# Altium schematic sheet FrontPanel.SchDoc
size A3; SheetNumber: 1; SheetTotal: 1
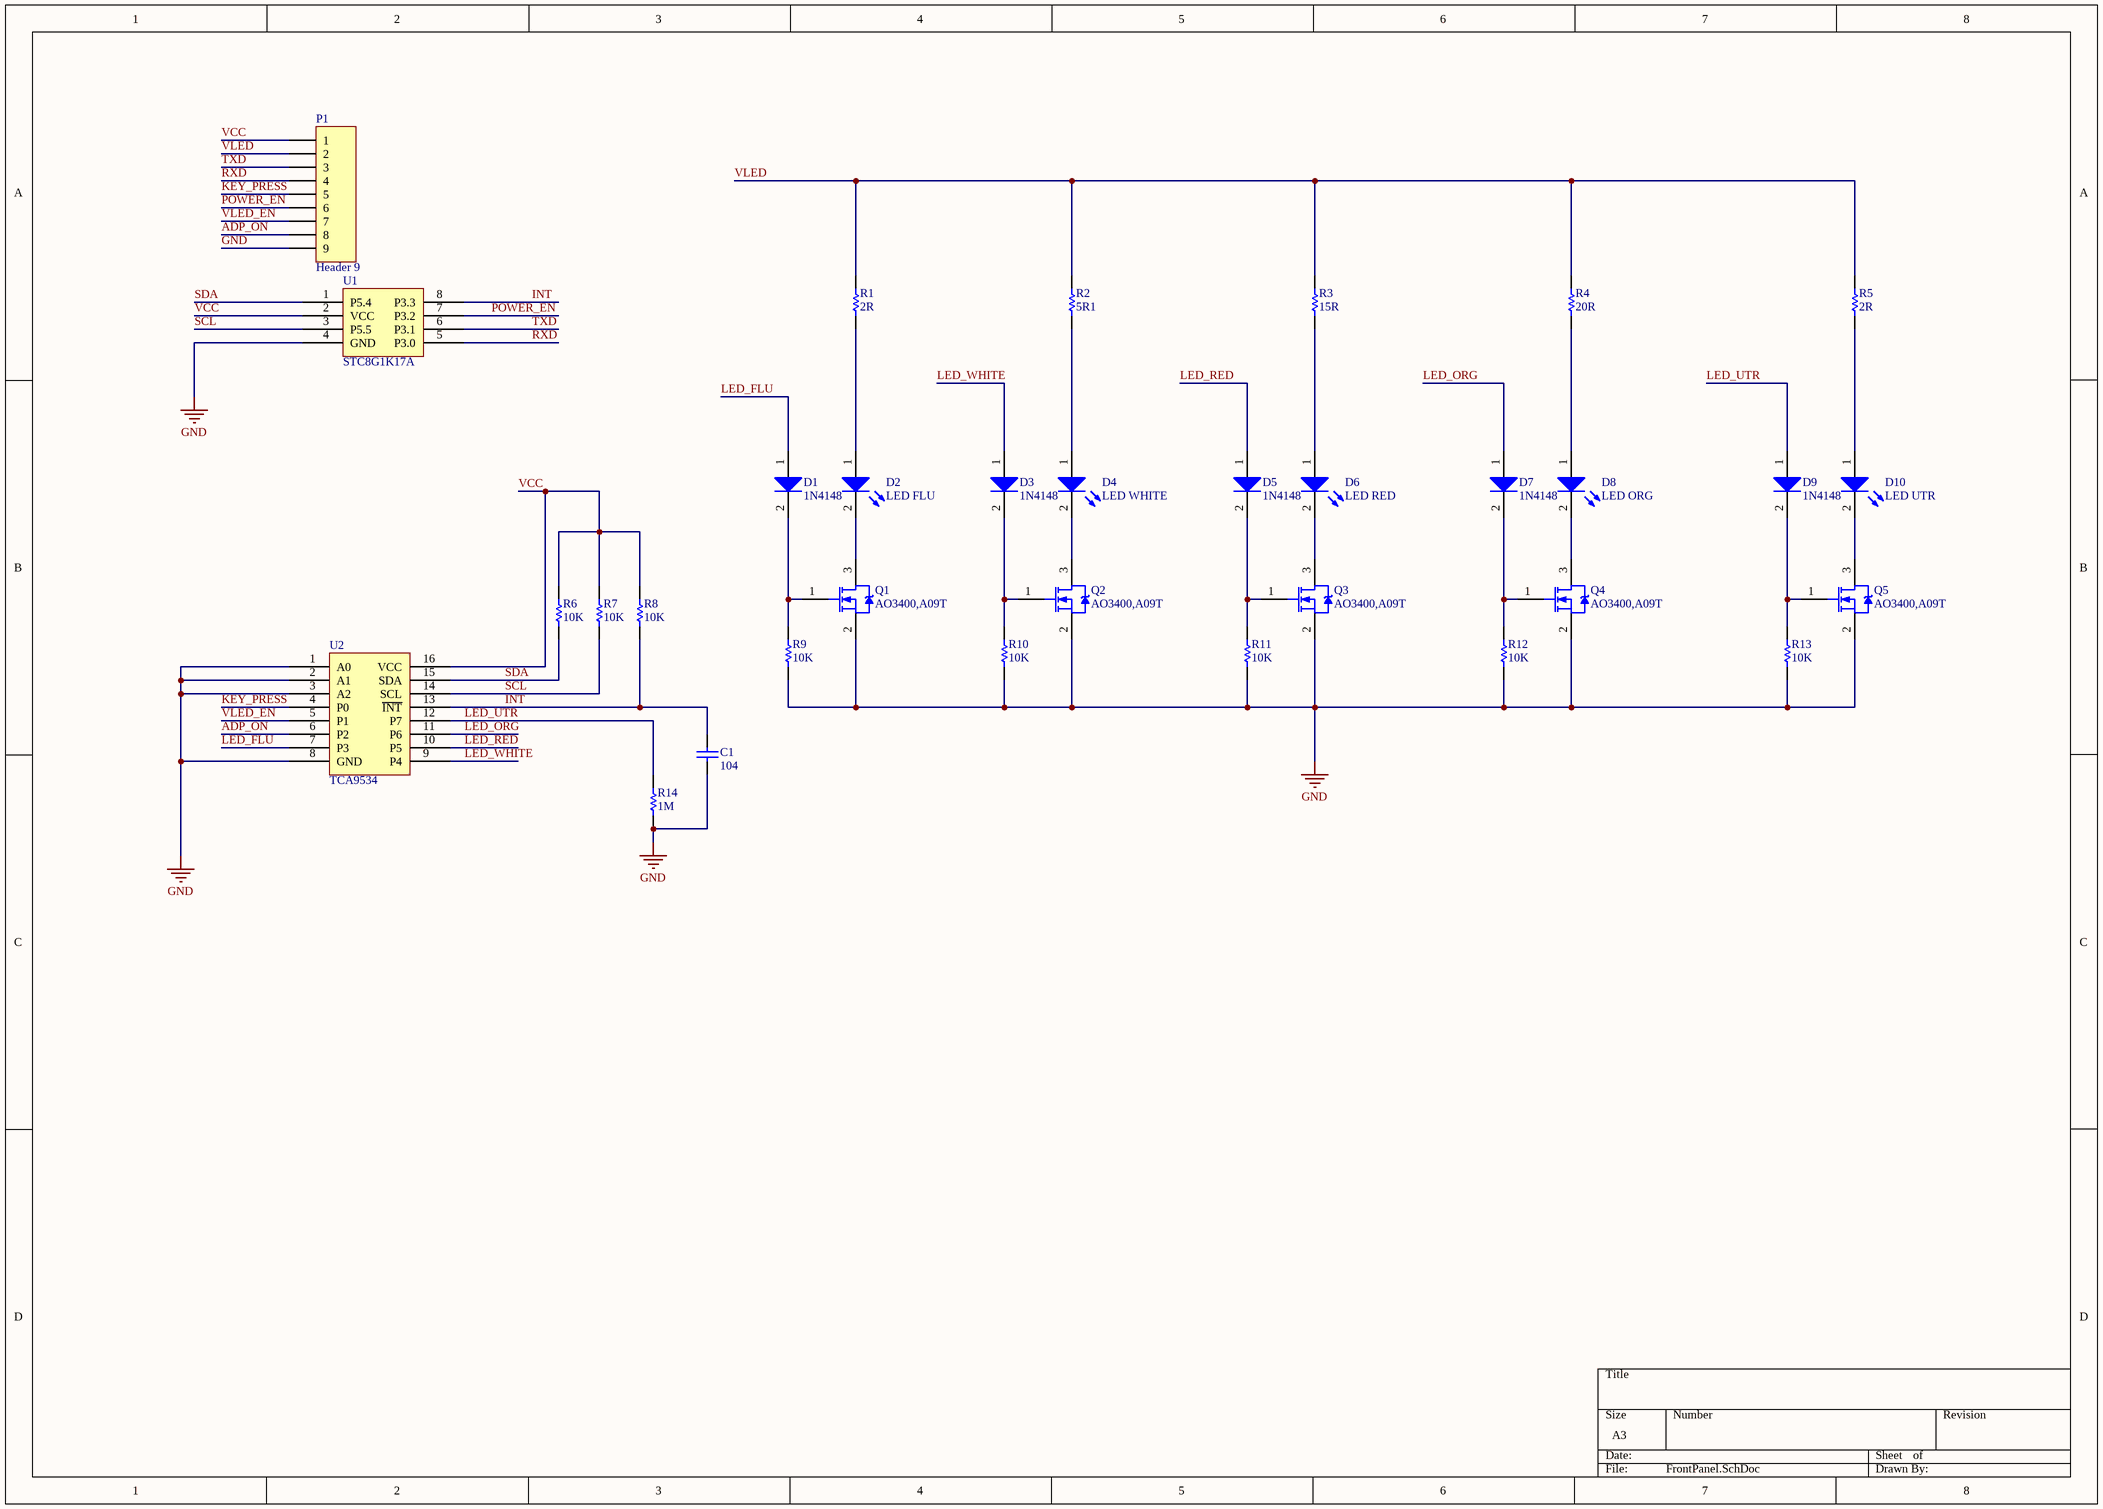
[diagram p0: FrontPanel.SchDoc]

## Parts
C1  value 104  [CAPC1608L]
D1  1N4148  [CD3216-1206]
D2  LED FLU  [LEDCHIP2835]
D3  1N4148  [CD3216-1206]
D4  LED WHITE  [LEDCHIP2835]
D5  1N4148  [CD3216-1206]
D6  LED RED  [LEDCHIP2835]
D7  1N4148  [CD3216-1206]
D8  LED ORG  [LEDCHIP2835]
D9  1N4148  [CD3216-1206]
D10  LED UTR  [LEDCHIP2835]
P1  Header 9  [HDR1X9]
Q1  AO3400,A09T  [SOT-23B_L]
Q2  AO3400,A09T  [SOT-23B_L]
Q3  AO3400,A09T  [SOT-23B_L]
Q4  AO3400,A09T  [SOT-23B_L]
Q5  AO3400,A09T  [SOT-23B_L]
R1  value 2R  [RESC1608L]
R2  value 5R1  [RESC1608L]
R3  value 15R  [RESC1608L]
R4  value 20R  [RESC1608L]
R5  value 2R  [RESC1608L]
R6  value 10K  [RESC1608L]
R7  value 10K  [RESC1608L]
R8  value 10K  [RESC1608L]
R9  value 10K  [RESC1608L]
R10  value 10K  [RESC1608L]
R11  value 10K  [RESC1608L]
R12  value 10K  [RESC1608L]
R13  value 10K  [RESC1608L]
R14  value 1M  [RESC1608L]
U1  STC8G1K17A  [SOP127P780-8M]
U2  TCA9534  [TSOP65P640-16AM]

## Nets
GND: C1.2 P1.9 Q1.2(S) Q2.2(S) Q3.2(S) Q4.2(S) Q5.2(S) R9.2 R10.2 R11.2 R12.2 R13.2 R14.2 U1.4(GND) U2.1(A0) U2.2(A1) U2.3(A2) U2.8(GND)
ADP_ON: P1.8 U2.6(P2)
INT: C1.1 R8.2 U1.8(P3.3) U2.13(~{INT})
KEY_PRESS: P1.5 U2.4(P0)
LED_FLU: D1.1(A) U2.7(P3)
LED_ORG: D7.1(A) U2.11(P6)
LED_RED: D5.1(A) U2.10(P5)
LED_UTR: D9.1(A) R14.1 U2.12(P7)
LED_WHITE: D3.1(A) U2.9(P4)
POWER_EN: P1.6 U1.7(P3.2)
RXD: P1.4 U1.5(P3.0)
SCL: R7.2 U1.3(P5.5) U2.14(SCL)
SDA: R6.2 U1.1(P5.4) U2.15(SDA)
TXD: P1.3 U1.6(P3.1)
VCC: P1.1 R6.1 R7.1 R8.1 U1.2(VCC) U2.16(VCC)
VLED: P1.2 R1.1 R2.1 R3.1 R4.1 R5.1
VLED_EN: P1.7 U2.5(P1)
NetD1_2: D1.2(K) Q1.1(G) R9.1
NetD2_1: D2.1(A) R1.2
NetD2_2: D2.2(K) Q1.3(D)
NetD3_2: D3.2(K) Q2.1(G) R10.1
NetD4_1: D4.1(A) R2.2
NetD4_2: D4.2(K) Q2.3(D)
NetD5_2: D5.2(K) Q3.1(G) R11.1
NetD6_1: D6.1(A) R3.2
NetD6_2: D6.2(K) Q3.3(D)
NetD7_2: D7.2(K) Q4.1(G) R12.1
NetD8_1: D8.1(A) R4.2
NetD8_2: D8.2(K) Q4.3(D)
NetD9_2: D9.2(K) Q5.1(G) R13.1
NetD10_1: D10.1(A) R5.2
NetD10_2: D10.2(K) Q5.3(D)

## Library data of the parts
C1 = Cap: Capacitor; Published: 8-Jun-2000; LatestRevisionDate: 17-Jul-2002; LatestRevisionNote: Re-released for DXP Platform.; PackageReference: RAD-0.3; Publisher: Altium Limited; PackageDescription: Radial Cap, Thru-Hole; 2 Leads; 0.3 in Pin Spacing
D1 D3 D5 D7 D9 = Diode: Default Diode; Published: 8-Jun-2000; LatestRevisionDate: 17-Jul-2002; LatestRevisionNote: Re-released for DXP Platform.; PackageVersion: Sep-1996; PackageReference: SMC; Publisher: Altium Limited; PackageDescription: DO-214-AB/SMC; 2 C-Bend Leads; Body 7.9 x 5.9 mm, inc. leads (LxW); Code_JEDEC: DO-214-AB
D2 D4 D6 D8 D10 = LED0: Typical INFRARED GaAs LED; Published: 8-Jun-2000; LatestRevisionDate: 08-Jul-2005; LatestRevisionNote: Mech Layer 1 removed.; PackageReference: LED-0; Publisher: Altium Limited; PackageDescription: LED; 2 Leads
P1 = Header 9: Header, 9-Pin; LatestRevisionDate: 17-Jul-2002; LatestRevisionNote: Re-released for DXP Platform.; Publisher: Altium Limited
Q1-Q5 = NMOS-2: N-Channel Power MOSFET; Note: Pin 2 is electrically connected to pin 4.; Published: 8-Jun-2000; LatestRevisionDate: 17-Jul-2002; LatestRevisionNote: Re-released for DXP Platform.; DatasheetVersion: PD-9.814; PackageVersion: Feb-1997; PackageReference: TO-220AB; Publisher: Altium Limited; PackageDescription: TO, Thru-Hole, Vertical, Heatsink Mounted; 3 In-Line Leads; Pitch 2.54 mm; ComponentLink1Description: Manufacturer Link; ComponentLink1URL: http://www.irf.com/
R1-R14 = Res1: Resistor; Published: 8-Jun-2000; LatestRevisionDate: 17-Jul-2002; LatestRevisionNote: Re-released for DXP Platform.; PackageReference: AXIAL-0.3; Publisher: Altium Limited; PackageDescription: Axial Device, Thru-Hole; 2 Leads; 0.3 in Pin Spacing